# EAGLE schematic relay-unit-atmega (EAGLE 6.5.0)
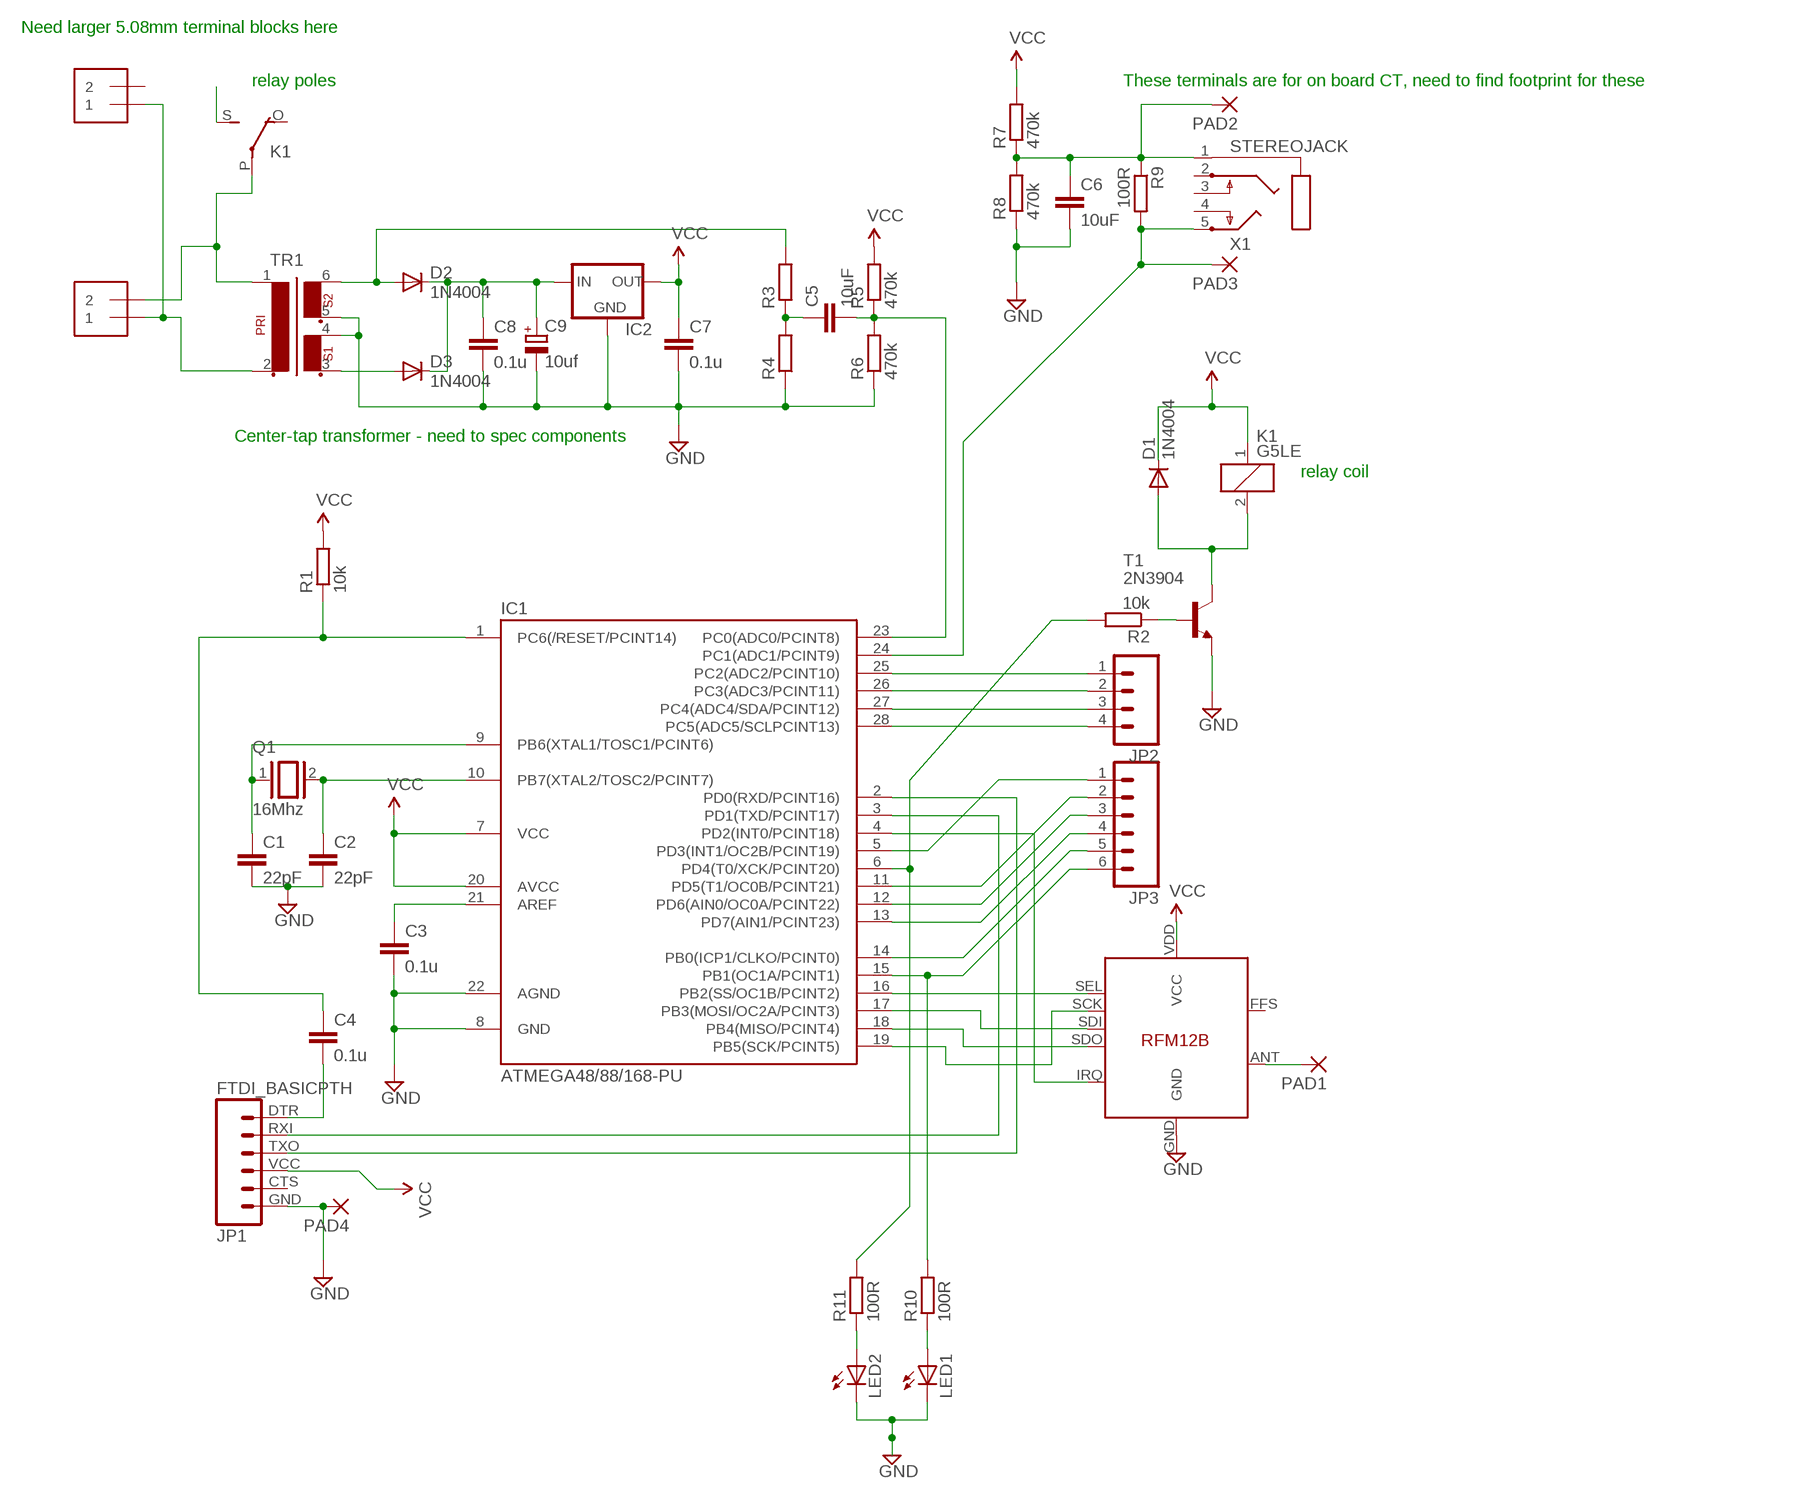
[diagram p0: schematic, sheet 1]

## Parts
C1  22pF  C2.5/2  [C2.5-2]
C2  22pF  C2.5/2  [C2.5-2]
C3  0.1u  C-EU025-024X044  [C025-024X044]
C4  0.1u  C-EU025-024X044  [C025-024X044]
C5  10uF  C-EU025-024X044  [C025-024X044]
C6  10uF  C-EU025-024X044  [C025-024X044]
C7  0.1u  C-EU025-024X044  [C025-024X044]
C8  0.1u  C-EU025-024X044  [C025-024X044]
C9  10uf  CPOL-EUE1.8-4  [E1,8-4]
D1  1N4004  [DO41-10]
D2  1N4004  [DO41-10]
D3  1N4004  [DO41-10]
IC1  ATMEGA48/88/168-PU  [DIL28-3]
IC2  MCP1700TRI  [TO92]
J1  1X2-3.5MM  [1X2-3.5MM]
J2  1X2-3.5MM  [1X2-3.5MM]
JP1  FTDI_BASICPTH  [FTDI_BASIC]
JP2  M04PTH  [1X04]
JP3  M06SIP  [1X06]
K1  G5LE  [G5LE]
LED1  LED3MM  [LED3MM]
LED2  LED3MM  [LED3MM]
PAD1  1,6/0,8  [1,6/0,8]
PAD2  1,6/0,8  [1,6/0,8]
PAD3  1,6/0,8  [1,6/0,8]
PAD4  1,6/0,8  [1,6/0,8]
Q1  16Mhz  XTAL/S  [QS]
R1  10k  R-EU_0204/7  [0204/7]
R2  10k  R-EU_0204/7  [0204/7]
R3  R-EU_0204/7  [0204/7]
R4  R-EU_0204/7  [0204/7]
R5  470k  R-EU_0204/7  [0204/7]
R6  470k  R-EU_0204/7  [0204/7]
R7  470k  R-EU_0204/7  [0204/7]
R8  470k  R-EU_0204/7  [0204/7]
R9  100R  R-EU_0204/7  [0204/7]
R10  100R  R-EU_0204/7  [0204/7]
R11  100R  R-EU_0204/7  [0204/7]
T1  2N3904  [TO92]
TR1  VP32  [VP32]
U$1  RFM12B  [RFM12B]
X1  STEREOJACK  [STX3100]

## Nets
GND: C1.2 C2.2 C3.2 C6.2 C7.2 C8.2 C9.- IC1.8(GND) IC1.22(AGND) IC2.1(GND) JP1.GND LED1.K(C) LED2.K(C) PAD4.1(P) R4.1 R6.1 R8.1 T1.3(E) TR1.4 TR1.5 U$1.GND
N$1: C1.1 IC1.9(PB6(XTAL1/TOSC1/PCINT6)) Q1.1
N$2: C2.1 IC1.10(PB7(XTAL2/TOSC2/PCINT7)) Q1.2
N$3: C4.2 JP1.DTR
N$4: C3.1 IC1.21(AREF)
N$5: IC1.5(PD3(INT1/OC2B/PCINT19)) JP3.1
N$6: IC1.16(PB2(SS/OC1B/PCINT2)) U$1.SEL
N$7: IC1.4(PD2(INT0/PCINT18)) U$1.IRQ
N$8: C4.1 IC1.1(PC6(/RESET/PCINT14)) R1.1
N$9: IC1.17(PB3(MOSI/OC2A/PCINT3)) U$1.SDI
N$10: IC1.19(PB5(SCK/PCINT5)) U$1.SCK
N$11: IC1.18(PB4(MISO/PCINT4)) U$1.SDO
N$12: PAD1.1(P) U$1.ANT
N$13: IC1.2(PD0(RXD/PCINT16)) JP1.TXO
N$14: IC1.3(PD1(TXD/PCINT17)) JP1.RXI
N$15: R2.1 T1.2(B)
N$16: D1.A K1.2 T1.1(C)
N$17: IC1.6(PD4(T0/XCK/PCINT20)) R2.2 R11.2
N$19: K1.S(2:S)
N$20: J1.1 J2.1 TR1.2
N$21: D2.A R3.2 TR1.6
N$22: D3.A TR1.3
N$23: C5.2 IC1.23(PC0(ADC0/PCINT8)) R5.1 R6.2
N$24: C5.1 R3.1 R4.2
N$25: IC1.24(PC1(ADC1/PCINT9)) PAD3.1(P) R9.2 X1.5
N$26: C6.1 PAD2.1(P) R7.1 R8.2 R9.1 X1.1
N$27: C8.1 C9.+ D2.C D3.C IC2.2(IN)
N$28: IC1.25(PC2(ADC2/PCINT10)) JP2.1
N$29: IC1.26(PC3(ADC3/PCINT11)) JP2.2
N$30: IC1.27(PC4(ADC4/SDA/PCINT12)) JP2.3
N$31: IC1.28(PC5(ADC5/SCLPCINT13)) JP2.4
N$32: IC1.11(PD5(T1/OC0B/PCINT21)) JP3.2
N$33: IC1.12(PD6(AIN0/OC0A/PCINT22)) JP3.3
N$34: IC1.13(PD7(AIN1/PCINT23)) JP3.4
N$35: IC1.14(PB0(ICP1/CLKO/PCINT0)) JP3.5
N$36: IC1.15(PB1(OC1A/PCINT1)) JP3.6 R10.2
N$37: LED1.A R10.1
N$38: LED2.A R11.1
N$40: J2.2 K1.P(2:P) TR1.1
VCC: C7.1 D1.C IC1.7(VCC) IC1.20(AVCC) IC2.3(OUT) JP1.VCC K1.1 R1.2 R5.2 R7.2 U$1.VDD(VCC)
Unconnected: J1.2 JP1.CTS K1.O(2:O) U$1.FFS X1.2 X1.3 X1.4

## Notes on the sheet
- Need larger 5.08mm terminal blocks here
- relay poles | These terminals are for on board CT, need to find footprint for these
- Center-tap transformer - need to spec components
- relay coil

## Library data of the parts
C1 C2 = capacitor-wima:C: CAPACITOR naming: grid - package width
C3-C8 = resistor:C-EU: CAPACITOR, European symbol
C9 = rcl:CPOL-EU: POLARIZED CAPACITOR, European symbol
D1-D3 = adafruit:1N4004: DIODE General purpose 1N400x type rectifier (With bigger pads) http://www.ladyada.net/library/pcb/eaglelibrary.html
IC1 = atmega8:ATMEGA48/88/168-PU
IC2 = adafruit:MCP1700: VOLTAGE REGULATOR
J1 J2 = adafruit:1X2: 3.5mm Terminal block http://www.ladyada.net/library/pcb/eaglelibrary.html
JP1 = SparkFun:FTDI_BASIC: FTDI Basic: 3.3V and 5V
JP2 = SparkFun:M04: Header 4 Standard 4-pin 0.1" header. Use with straight break away headers (SKU : PRT-00116), right angle break away headers (PRT-00553), swiss pins (PRT-00743), machine pins (PRT-00117), and female headers (PRT-00115). Molex polarized connector foot print use with SKU : PRT-08231 with associated crimp pins and housings. 1MM SMD Version SKU: PRT-10208
JP3 = SparkFun:M06: Header 6 Standard 6-pin 0.1" header. Use with straight break away headers (SKU : PRT-00116), right angle break away headers (PRT-00553), swiss pins (PRT-00743), machine pins (PRT-00117), and female headers (PRT-00115). Molex polarized connector foot print use with SKU : PRT-08094 with associated crimp pins and housings. NOTES ON THE VARIANTS LOCK and LOCK_LONGPADS... This footprint was designed to help hold the alignment of a through-hole component (i.e. 6-pin header) while soldering it into place. You may notice that each hole has been shifted either up or down by 0.005 of an inch from it's more standard position (which is a perfectly straight line). This slight alteration caused the pins (the squares in the middle) to touch the edges of the holes. Because they are alternating, it causes a "brace" to hold the component in place. 0.005 has proven to be the perfect amount of "off-center" position when using our standard breakaway headers. Although looks a little odd when you look at the bare footprint, once you have a header in there, the alteration is very hard to notice. Also, if you push a header all the way into place, it is covered up entirely on the bottom side. This idea of altering the position of holes to aid alignment will be further integrated into the Sparkfun Library for other footprints. It can help hold any component with 3 or more connection pins.
K1 = relay:G5LE: RELAY 1 x switch, 10 A/120 V AC, 8 A/30 V DC, Omron; OC_FARNELL: unknown; OC_NEWARK: unknown
LED1 LED2 = adafruit:LED: LED OSRAM: - CHIPLED LG R971, LG N971, LY N971, LG Q971, LY Q971, LO R971, LY R971 LH N974, LH R974 LS Q976, LO Q976, LY Q976 LO Q996 - Hyper CHIPLED LW Q18S LB Q993, LB Q99A, LB R99A - SideLED LS A670, LO A670, LY A670, LG A670, LP A670 LB A673, LV A673, LT A673, LW A673 LH A674 LY A675 LS A676, LA A676, LO A676, LY A676, LW A676 LS A679, LY A679, LG A679 - Hyper Micro SIDELED® LS Y876, LA Y876, LO Y876, LY Y876 LT Y87S - SmartLED LW L88C, LW L88S LB L89C, LB L89S, LG L890 LS L89K, LO L89K, LY L89K LS L896, LA L896, LO L896, LY L896 - TOPLED LS T670, LO T670, LY T670, LG T670, LP T670 LSG T670, LSP T670, LSY T670, LOP T670, LYG T670 LG T671, LOG T671, LSG T671 LB T673, LV T673, LT T673, LW T673 LH T674 LS T676, LA T676, LO T676, LY T676, LB T676, LH T676, LSB T676, LW T676 LB T67C, LV T67C, LT T67C, LS T67K, LO T67K, LY T67K, LW E67C LS E67B, LA E67B, LO E67B, LY E67B, LB E67C, LV E67C, LT E67C LW T67C LS T679, LY T679, LG T679 LS T770, LO T770, LY T770, LG T770, LP T770 LB T773, LV T773, LT T773, LW T773 LH T774 LS E675, LA E675, LY E675, LS T675 LS T776, LA T776, LO T776, LY T776, LB T776 LHGB T686 LT T68C, LB T68C - Hyper Mini TOPLED® LB M676 - Mini TOPLED Santana® LG M470 LS M47K, LO M47K, LY M47K Source: http://www.osram.convergy.de/
PAD1-PAD4 = wirepad:1,6/0,8: THROUGH-HOLE PAD
Q1 = special:XTAL/S: CRYSTAL
R1-R11 = rcl:R-EU_: RESISTOR, European symbol
T1 = transistor:2N3904: NPN TRANSISTOR
TR1 = trafo:VP32: TRANSFORMER 1 primary winding, 2 secondary windings BLOCK
U$1 = JeeParts:RFM12B
X1 = adafruit:STEREOJACK: MIC/HEADPHONE JACK Stereo jack with two switches. Kycon STX3100, CUI SJ1-3555NG and/or 4UCon 05544